# Altium schematic sheet medibox.SchDoc
size A2; Author: Aakashdip Dey; DrawnBy: Aakashdip Dey; Organization: Vellore Institute of Technology; Address1: ADDRESS 1; Address2: ADDRESS 2; Address3: ADDRESS 3; Address4: ADDRESS 4; =Title: MediBox Schematic; DocumentNumber: 2; Revision: -; SheetNumber: 1; SheetTotal: 1; ENG_APP_DATE: --/--/--; DSN_APP_DATE: --/--/--; CHK_APP_DATE: --/--/--
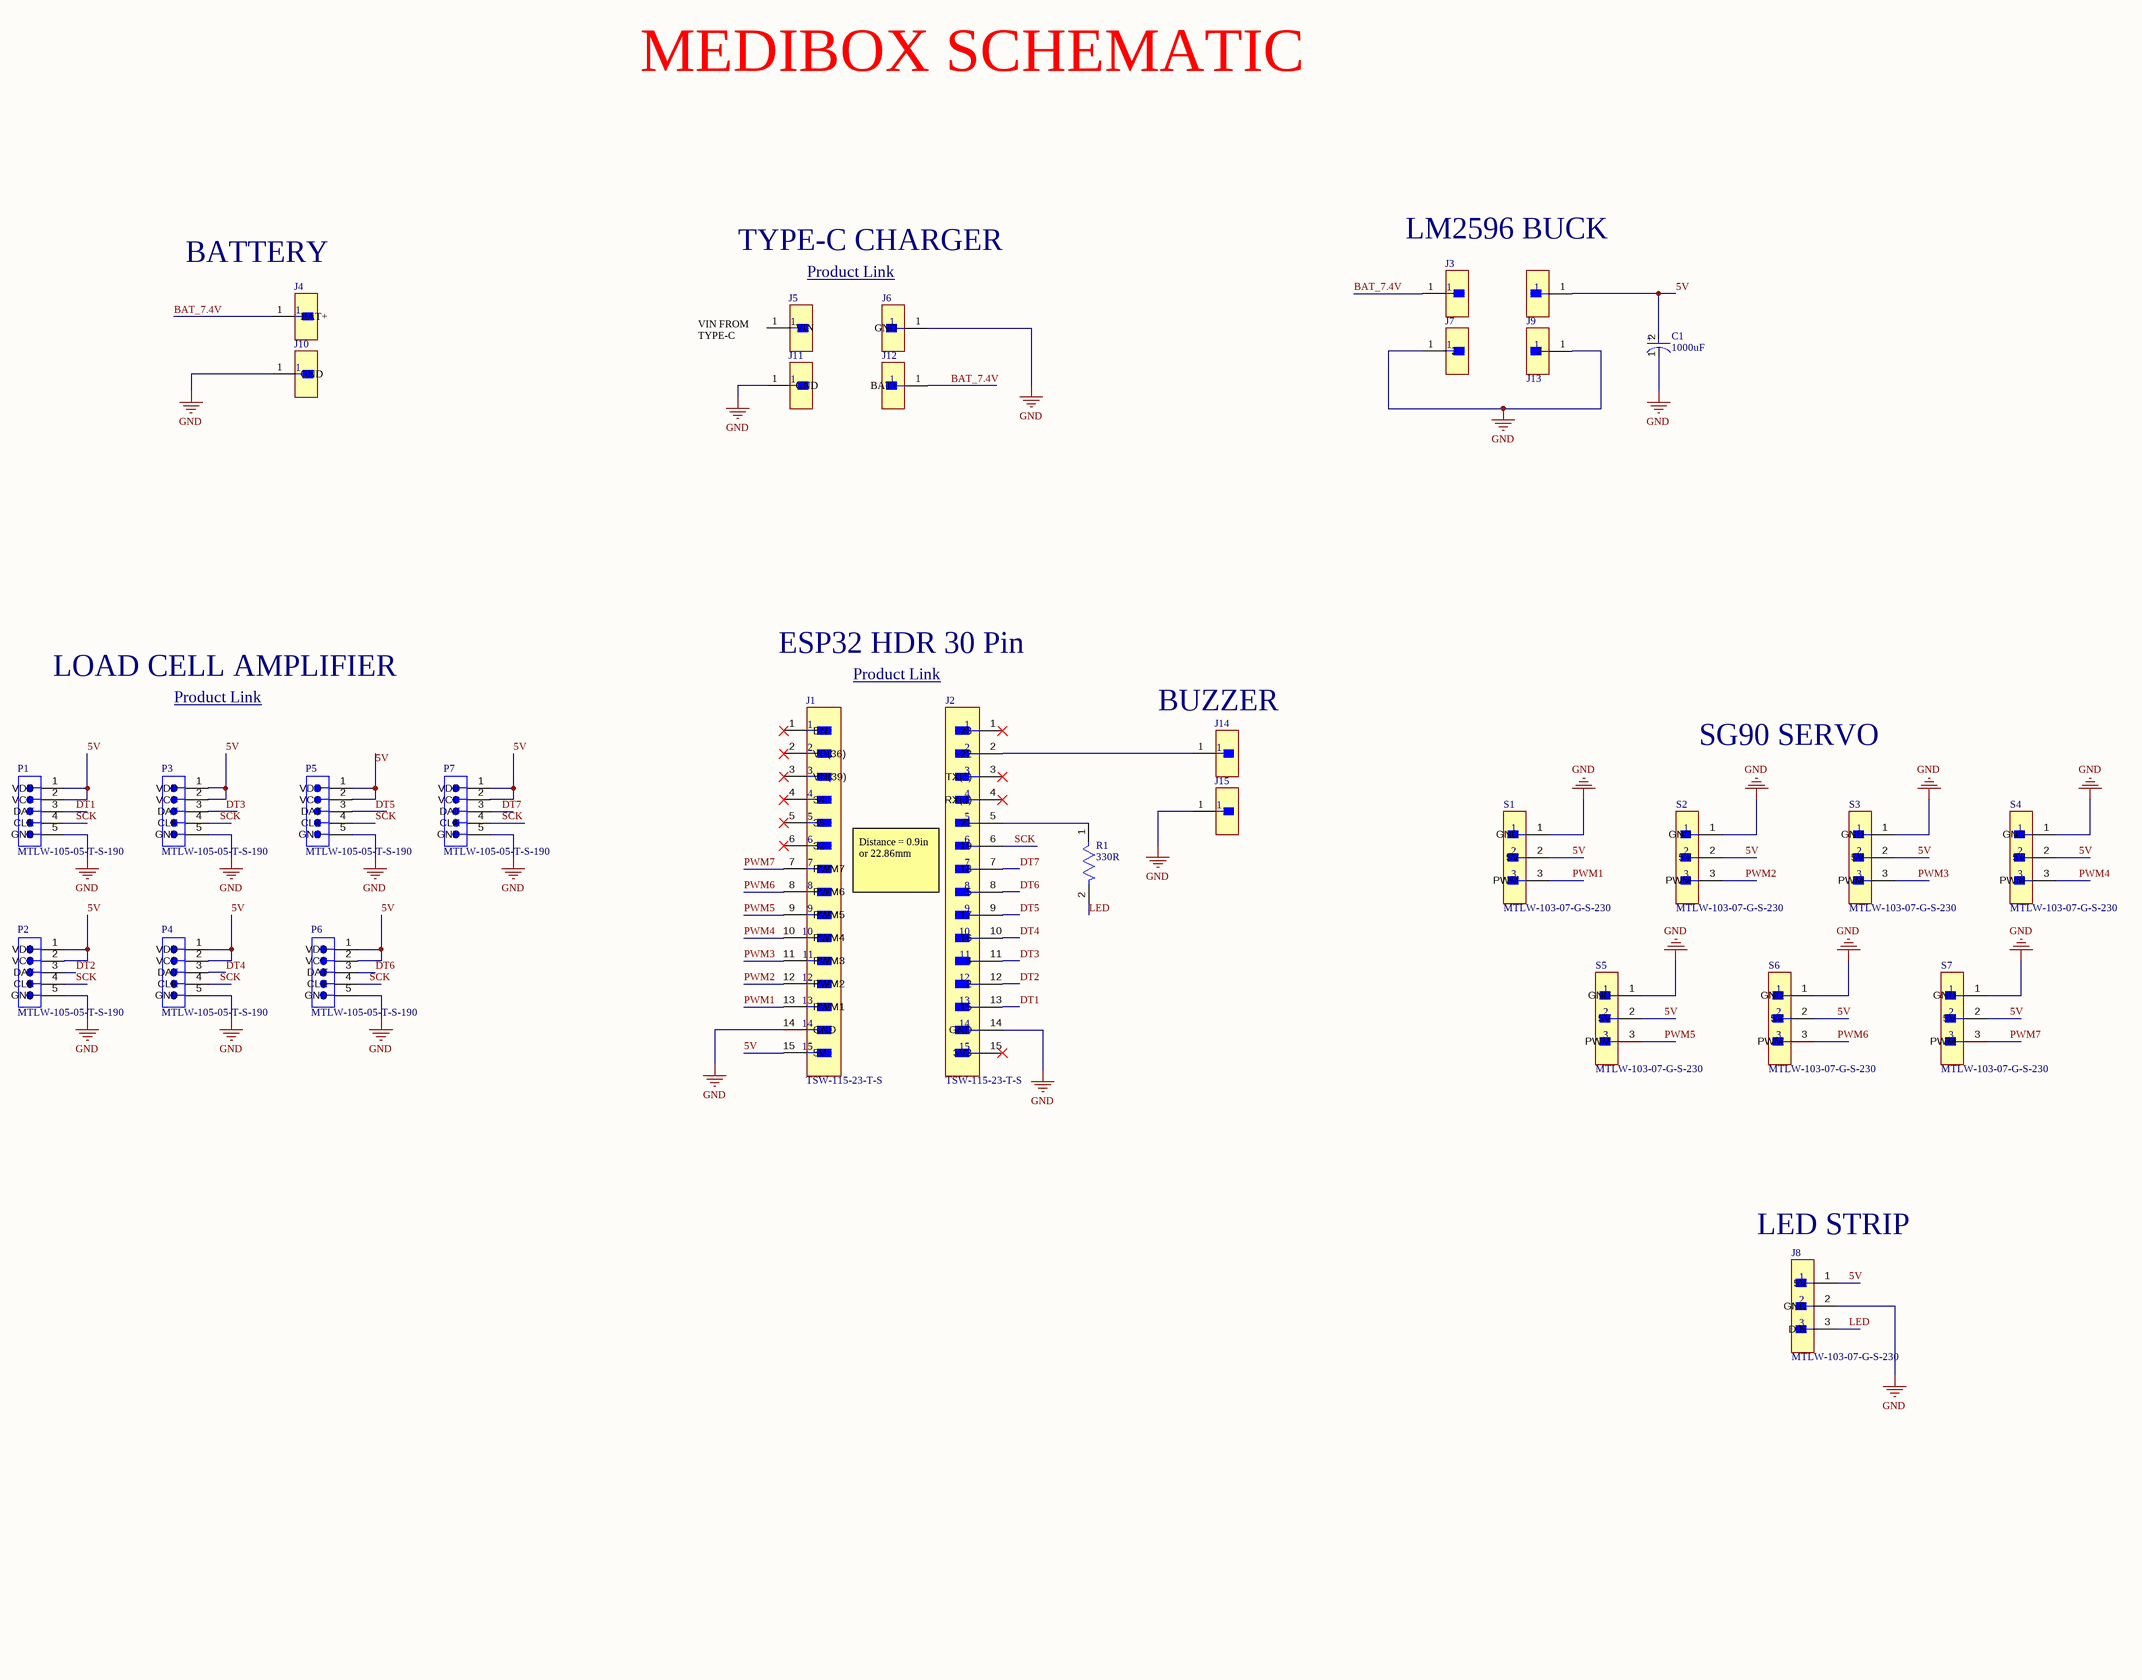
[diagram p0: medibox.SchDoc]

## Parts
C1  1000uF  [FP-RAD-TH-D_10_0_5-L_25_2-MFG]
J1  TSW-115-23-T-S  [FP-TSW-115-23-T-S-MFG]
J2  TSW-115-23-T-S  [FP-TSW-115-23-T-S-MFG]
J3  68000-401HLF  [FP-68000-401HLF-MFG]  (value not drawn)
J4  68000-401HLF  [FP-68000-401HLF-MFG]  (value not drawn)
J5  68000-401HLF  [FP-68000-401HLF-MFG]  (value not drawn)
J6  68000-401HLF  [FP-68000-401HLF-MFG]  (value not drawn)
J7  68000-401HLF  [FP-68000-401HLF-MFG]  (value not drawn)
J8  MTLW-103-07-G-S-230  [FP-MTLW-103-07-G-S-230-MFG]
J9  68000-401HLF  [FP-68000-401HLF-MFG]  (value not drawn)
J10  68000-401HLF  [FP-68000-401HLF-MFG]  (value not drawn)
J11  68000-401HLF  [FP-68000-401HLF-MFG]  (value not drawn)
J12  68000-401HLF  [FP-68000-401HLF-MFG]  (value not drawn)
J13  68000-401HLF  [FP-68000-401HLF-MFG]  (value not drawn)
J14  68000-401HLF  [FP-68000-401HLF-MFG]  (value not drawn)
J15  68000-401HLF  [FP-68000-401HLF-MFG]  (value not drawn)
P1  MTLW-105-05-T-S-190  [SMTC-MTLW-105-05-X-S-190]
P2  MTLW-105-05-T-S-190  [SMTC-MTLW-105-05-X-S-190]
P3  MTLW-105-05-T-S-190  [SMTC-MTLW-105-05-X-S-190]
P4  MTLW-105-05-T-S-190  [SMTC-MTLW-105-05-X-S-190]
P5  MTLW-105-05-T-S-190  [SMTC-MTLW-105-05-X-S-190]
P6  MTLW-105-05-T-S-190  [SMTC-MTLW-105-05-X-S-190]
P7  MTLW-105-05-T-S-190  [SMTC-MTLW-105-05-X-S-190]
R1  330R  [FP-RMCF0805-IPC_C]
S1  MTLW-103-07-G-S-230  [FP-MTLW-103-07-G-S-230-MFG]
S2  MTLW-103-07-G-S-230  [FP-MTLW-103-07-G-S-230-MFG]
S3  MTLW-103-07-G-S-230  [FP-MTLW-103-07-G-S-230-MFG]
S4  MTLW-103-07-G-S-230  [FP-MTLW-103-07-G-S-230-MFG]
S5  MTLW-103-07-G-S-230  [FP-MTLW-103-07-G-S-230-MFG]
S6  MTLW-103-07-G-S-230  [FP-MTLW-103-07-G-S-230-MFG]
S7  MTLW-103-07-G-S-230  [FP-MTLW-103-07-G-S-230-MFG]

## Nets
GND: C1.1(C) J1.14(GND) J2.14(GND) J6.1(GND) J7.1(2) J8.2(GND) J10.1(GND) J11.1(GND) J13.1(2) J15.1 P1.5(GND) P2.5(GND) P3.5(GND) P4.5(GND) P5.5(GND) P6.5(GND) P7.5(GND) S1.1(GND) S2.1(GND) S3.1(GND) S4.1(GND) S5.1(GND) S6.1(GND) S7.1(GND)
5V: C1.2(A) J1.15(5V) J8.1(5V) J9.1 P1.1(VDD) P1.2(VCC) P2.1(VDD) P2.2(VCC) P3.1(VDD) P3.2(VCC) P4.1(VDD) P4.2(VCC) P5.1(VDD) P5.2(VCC) P6.1(VDD) P6.2(VCC) P7.1(VDD) P7.2(VCC) S1.2(5V) S2.2(5V) S3.2(5V) S4.2(5V) S5.2(5V) S6.2(5V) S7.2(5V)
BAT_7.4V: J3.1 J4.1(BAT+) J12.1(BAT+)
DT1: J2.13(15) P1.3(DAT)
DT2: J2.12(2) P2.3(DAT)
DT3: J2.11(4) P3.3(DAT)
DT4: J2.10(16) P4.3(DAT)
DT5: J2.9(17) P5.3(DAT)
DT6: J2.8(5) P6.3(DAT)
DT7: J2.7(18) P7.3(DAT)
LED: J8.3(DIN) R1.2
PWM1: J1.13(PWM1) S1.3(PWM)
PWM2: J1.12(PWM2) S2.3(PWM)
PWM3: J1.11(PWM3) S3.3(PWM)
PWM4: J1.10(PWM4) S4.3(PWM)
PWM5: J1.9(PWM5) S5.3(PWM)
PWM6: J1.8(PWM6) S6.3(PWM)
PWM7: J1.7(PWM7) S7.3(PWM)
SCK: J2.6(19) P1.4(CLK) P2.4(CLK) P3.4(CLK) P4.4(CLK) P5.4(CLK) P6.4(CLK) P7.4(CLK)
NetJ2_2: J2.2(22) J14.1
NetJ2_5: J2.5(21) R1.1

Not connected (* = marked no-connect by the designer): J1 1(EN)* 2(VP(36))* 3(VN(39))* 4(34)* 5(35)* 6(32)*; J2 1(23)* 3(TX(1))* 4(RX(3))* 15(3V3)*; J5 1(VIN)

## Notes on the sheet
- MEDIBOX SCHEMATIC
- BATTERY
- TYPE-C CHARGER
- Product Link <https://robu.in/product/2s-8-4v-1a-18650-lithium-battery-charger-module-type-c/>
- LM2596 BUCK
- (near J5) VIN FROM TYPE-C
- LOAD CELL AMPLIFIER
- ESP32 HDR 30 Pin
- Product Link <https://www.amazon.in/roboCraze-Development-Bluetooth-Ultra-Low-Consumption/dp/B072MLLZGL?adgrpid=1323813607735402&dib=eyJ2IjoiMSJ9.MzRUSfjYxHGaV8-d0ya4XmsmBDoDmNVqSv6wWzKtC87skYjiSLmBT4ySpCyFtRFHU2xYHkwpxYPHMxhvZqwZzYaualBXLiAZeM737r_bAMTCxM7y-eqprsg16yCd4kw3iO-jp6YodldZGf8q5WqWnLve2el3MV_KhkBT1I9rpof7yvZmmte8xDSGSh-wtcHiZS4lyEnxMC3NNdsykRf_xrpeWP_C4o_QjWvlCq9LReg.9KYex2xclhe8xnD1W6pubWp9B5jGGQZRyeYnwpMkME8&dib_tag=se&hvadid=82738617105668&hvbmt=be&hvdev=c&hvlocphy=155596&hvnetw=o&hvqmt=e&hvtargid=kwd-82739228604072%3Aloc-90&hydadcr=15414_2338258&keywords=esp32&mcid=4472825c29cc31f39d49f7924def005a&qid=1786792709&sr=8-3&th=1>
- Product Link <https://robu.in/product/smartelex-load-cell-amplifier-hx711/>
- (near J14) BUZZER
- SG90 SERVO
- Distance = 0.9in or 22.86mm
- (near J8) LED STRIP
- DWG. NO.
- REV.
- SHT.
- REVISION
- DESCRIPTION
- DATE
- APPROVED
- THIS DOCUMENT AND THE DATA DISCLOSED HEREIN OR HEREWITH IS THE PROPERTY OF ALTIUM LIMITED AND MAY BE FREELY DISTRIBUTED IN WHOLE. NO RIGHTS ARE RESERVED OR EXPRESS OR IMPLIED WARANTEE GIVEN.
- ENG:
- DSN:
- APPROVALS
- PROJECT
- DOCUMENT REVISION:
- DESIGN ITEM:
- CHK:
- BOM:
- REFERENCE DOCUMENTS
- PROJECT REVISION:
- TITLE
- FAB DWG:
- PCB DWG:
- ASSY DWG:
- SCALE:
- SIZE
- C
- CAGE CODE
- FILE NAME
- DWG NO.
- SHEET
- OF
- REV
- (in symbol CMP-05427-002159-1) +

## Library data of the parts
C1 = CMP-05427-002159-1: EEUFC1C102B Aluminum Electrolytic Capacitors (Radial Lead Type) AEC-Q200 Qualified 1000uF ±20% 16V; Polarity: Polar; Life (Hours): 3000Hour; ESR (Equivalent Series Resistance): 45mR; Capacitance: 1mF; Ripple Current: 1.44A; Lead Diameter: 0.6mm; Tolerance: 20%; Min Operating Temperature: -55°C; Case/Package: Radial; Voltage Rating: 16V; Diameter: 10mm; Ratings: AEC-Q200; Mount: Through Hole; Series: FC; Radiation Hardening: No; Length: 25mm; Max Operating Temperature: 105°C; Package Quantity: 500; Voltage Rating (DC): 16V; Impedance: 45mR; RoHS Compliant: Yes; Lead Pitch: 5mm; Packaging: Ammo Pack; Height: 25mm; Termination: Radial; Height - Seated (Max): 1.063inch
J1 J2 = CMP-02766-001466-1: CONN HEADER VERT 15POS 2.54MM; Connector Type: Male Pin; Number of Contacts: 15; Gender: Male; Pitch: 0.1inch; Termination: Solder; Packaging: Bulk; Lead Free: Lead Free; Housing Color: Black; Housing Material: Plastic; Color: Black; RoHS Compliant: Yes; Contact Type: Male Pin; Width: 2.54mm; Mount: Through Hole; Contact Material: Bronze; Number of Rows: 1; Radiation Hardening: No; Number of Positions: 15; Length: 38.1mm; REACH SVHC: No SVHC; Height: 2.54mm; Contact Plating: Tin; Series: TSW; Contact Mating Length: 0.23inch
J3-J7 J9-J15 = CMP-15126-126518178-1: 68000-401HLF Conn Unshrouded Header HDR 1 POS Solder ST Top Entry Thru-Hole BergStik® Bulk; Mating Post Length: 5.84mm; Number of Positions: 1; Lead Length: 2.41mm; Voltage Rating: 110V; Insulation Resistance: 5GΩ; Current Rating: 3A; Max Voltage Rating (AC): 1.5kV; Gender: Male; Connector Type: Male Pin; Pitch: 2.54mm; Mount: Through Hole; Height: 8.79mm; Depth: 2.41mm; Min Operating Temperature: -65°C; Schedule B: 8535908040, 8535908040; Max Operating Temperature: 125°C; Housing Color: Black; Contact Mating Length: 5.842mm; Contact Material: Bronze, Nickel, Tin; Orientation: Straight; Contact Plating: Tin; Color: Black; Lead Pitch: 2.54mm; Radiation Hardening: No; Packaging: Bulk; Contact Gender: Male; RoHS: Compliant; Number of Rows: 1; Number of Contacts: 1; Housing Material: Thermoplastic; Length: 2.54mm; NexarPartId: 126518178; Number of Pins: 1; Termination: Solder
J8 S1-S7 = CMP-02766-001679-1: CONN HEADER VERT 3POS 2.54MM; Max Current Rating: 3A; Number of Contacts: 3; Gender: Male; Contact Material: Bronze; Pitch: 2.54mm; Housing Material: Polymer; Contact Plating: Gold; Radiation Hardening: No; Depth: 2.48mm; Packaging: Bulk; Number of Rows: 1; Max Operating Temperature: 125°C; Housing Color: Black; Termination: Solder; Min Operating Temperature: -55°C; Length: 7.62mm; RoHS Compliant: Yes; Orientation: Straight
P1-P7 = CMP-1024-00077-1: Low Profile .025" SQ Post Header, Through-hole, Vertical, -55 to 105 degC, 2.54 mm Pitch, 5-Pin, Male, RoHS; Manufacturer: Samtec; Pitch: 2.54 mm; RoHS: True; Temperature Range: -55 to 105 degC; Orientation: Vertical; ComponentLink1Description: Manufacturer URL; DatasheetVersion: F-214; ComponentLink3URL: http://www.samtec.com/documents/webfiles/cpdf/MTLW-1XX-XX-XX-X-XXX-XX-XX-MKT1.pdf; ComponentLink2URL: http://www.samtec.com/documents/webfiles/pdf/MTLW_TH.PDF; Mounting Technology: Through-hole; ComponentLink1URL: http://www.samtec.com; ComponentLink2Description: Datasheet; PartNumber: MTLW-105-05-T-S-190; ComponentLink3Description: Package Specification; PackageVersion: T, 6/1991; PackageReference: MTLW-105-05-X-S-190; PackageDescription: Low Profile Terminal Assembly
R1 = CMP-26527-000132-1: RMCF0805FT330R 330Ω ±1% 0.125W 0805 Thick Film Chip Resistor AEC-Q200 compliant; Temperature Coefficient: 100ppm/°C; Max Power Dissipation: 125mW; Height: 0.026inch; Tolerance: 1%; Packaging: Tape and Reel; Case/Package: 0805; RoHS Compliant: Yes; Min Operating Temperature: -55°C; Radiation Hardening: No; Resistance: 330R; Construction: Rectangular; Features: Automotive AEC-Q200; Width: 0.049inch; Case Code (Metric): 2012; Case Code (Imperial): 0805; Series: RMCF; Depth: 1.25mm; Lead Free: Lead Free; Number of Terminations: 2; Military Standard: Not; Length: 0.079inch; Mount: Surface Mount; Resistor Type: Thick Film; Max Operating Temperature: 155°C; Contact Plating: Tin